# EAGLE design CRDC (EAGLE 9.1.3)
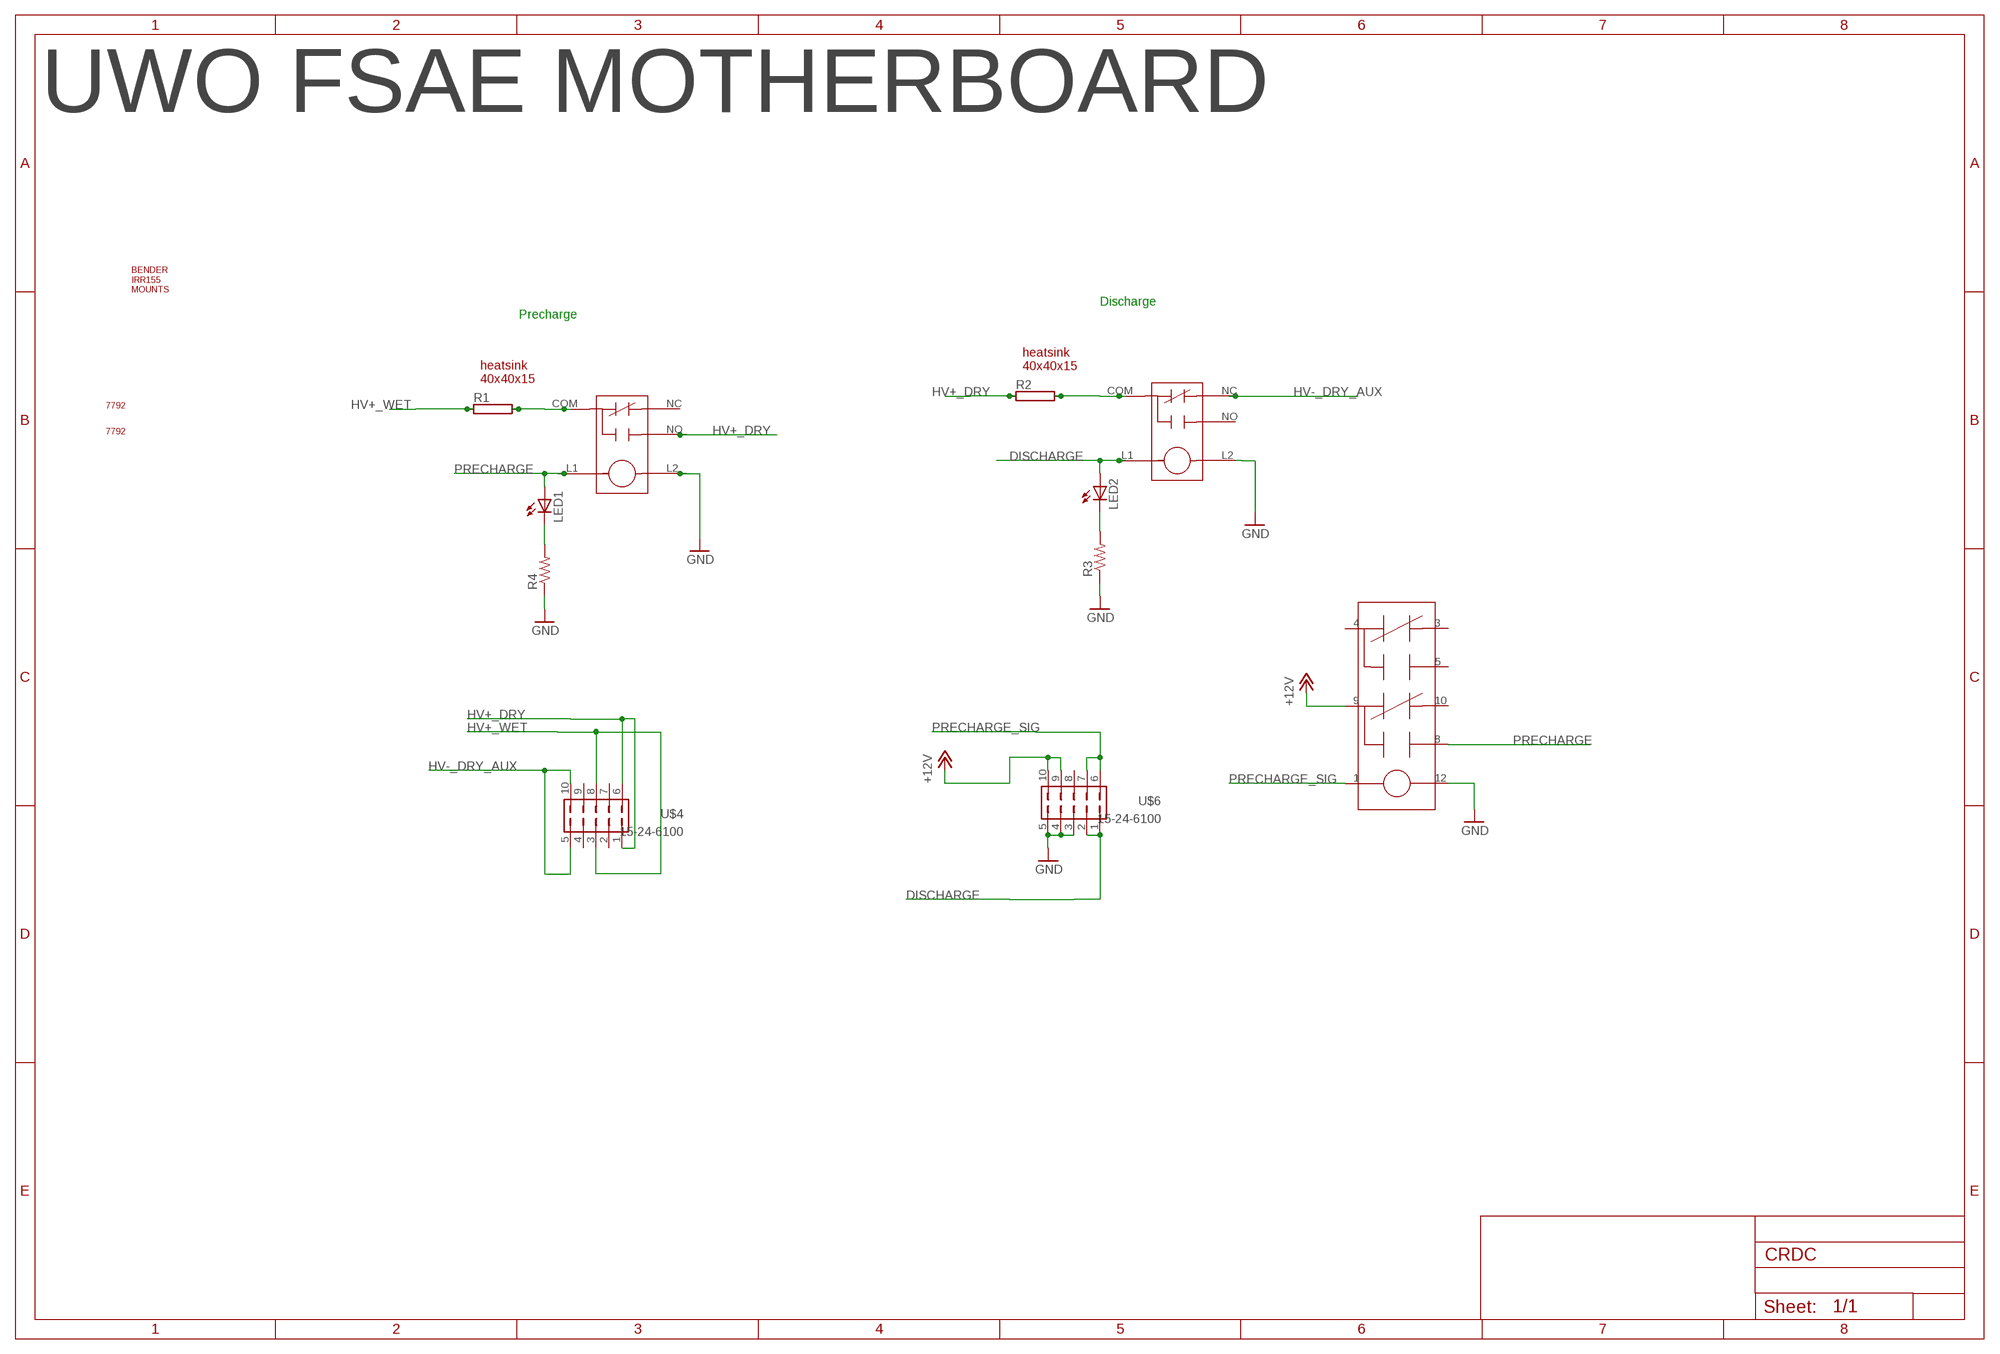
[diagram p0: schematic, sheet 1]

## Parts
LED1  LED3MM  [LED3MM]
LED2  LED3MM  [LED3MM]
R1  RMG100-H  [TO-247-2H]
R2  RMG100-H  [TO-247-2H]
R3  R-US_R0805  [R0805]
R4  R-US_R0805  [R0805]
U$1  G81C335  [G81C335]
U$2  G81C335  [G81C335]
U$3  BENDER_IRR155  [BENDER_IRR155]
U$4  15-24-6100  [15-24-6100]
U$5  7792  [7792]
U$6  15-24-6100  [15-24-6100]
U$7  V23079B1203B301  [V23079B1203B301]
U$8  HEATSINK40X40X15  [HEATSINK40X40X15]
U$9  HEATSINK40X40X15  [HEATSINK40X40X15]
U$10  7792  [7792]

## Nets
+12V: U$6.9 U$6.10 U$7.9
DISCHARGE: LED2.A U$2.L1 U$6.1 U$6.2
GND: R3.1 R4.1 U$1.L2 U$2.L2 U$6.3 U$6.4 U$6.5 U$7.12
HV+_DRY [HV]: R2.1 U$1.NO U$4.1 U$4.6
HV+_WET [HV]: R1.1 U$4.3 U$4.8
HV-_DRY_AUX [HV]: U$2.NC U$4.5 U$4.10
N$1: LED2.K(C) R3.2
N$4: R2.2 U$2.COM
N$5: LED1.K(C) R4.2
N$21: R1.2 U$1.COM
PRECHARGE: LED1.A U$1.L1 U$7.8
PRECHARGE_SIG: U$6.6 U$6.7 U$7.1
Unconnected: U$1.NC U$2.NO U$4.2 U$4.4 U$4.7 U$4.9 U$6.8 U$7.3 U$7.4 U$7.5 U$7.10

## Notes on the sheet
- UWO FSAE MOTHERBOARD
- Discharge
- Precharge

## Library data of the parts
LED1 LED2 = ACC-MB-R0:LED: LED OSRAM: - CHIPLED LG R971, LG N971, LY N971, LG Q971, LY Q971, LO R971, LY R971 LH N974, LH R974 LS Q976, LO Q976, LY Q976 LO Q996 - Hyper CHIPLED LW Q18S LB Q993, LB Q99A, LB R99A - SideLED LS A670, LO A670, LY A670, LG A670, LP A670 LB A673, LV A673, LT A673, LW A673 LH A674 LY A675 LS A676, LA A676, LO A676, LY A676, LW A676 LS A679, LY A679, LG A679 - Hyper Micro SIDELED® LS Y876, LA Y876, LO Y876, LY Y876 LT Y87S - SmartLED LW L88C, LW L88S LB L89C, LB L89S, LG L890 LS L89K, LO L89K, LY L89K LS L896, LA L896, LO L896, LY L896 - TOPLED LS T670, LO T670, LY T670, LG T670, LP T670 LSG T670, LSP T670, LSY T670, LOP T670, LYG T670 LG T671, LOG T671, LSG T671 LB T673, LV T673, LT T673, LW T673 LH T674 LS T676, LA T676, LO T676, LY T676, LB T676, LH T676, LSB T676, LW T676 LB T67C, LV T67C, LT T67C, LS T67K, LO T67K, LY T67K, LW E67C LS E67B, LA E67B, LO E67B, LY E67B, LB E67C, LV E67C, LT E67C LW T67C LS T679, LY T679, LG T679 LS T770, LO T770, LY T770, LG T770, LP T770 LB T773, LV T773, LT T773, LW T773 LH T774 LS E675, LA E675, LY E675, LS T675 LS T776, LA T776, LO T776, LY T776, LB T776 LHGB T686 LT T68C, LB T68C - Hyper Mini TOPLED® LB M676 - Mini TOPLED Santana® LG M470 LS M47K, LO M47K, LY M47K Source: http://www.osram.convergy.de LUXEON: - LUMILED® LXK2-PW12-R00, LXK2-PW12-S00, LXK2-PW14-U00, LXK2-PW14-V00 LXK2-PM12-R00, LXK2-PM12-S00, LXK2-PM14-U00 LXK2-PE12-Q00, LXK2-PE12-R00, LXK2-PE12-S00, LXK2-PE14-T00, LXK2-PE14-U00 LXK2-PB12-K00, LXK2-PB12-L00, LXK2-PB12-M00, LXK2-PB14-N00, LXK2-PB14-P00, LXK2-PB14-Q00 LXK2-PR12-L00, LXK2-PR12-M00, LXK2-PR14-Q00, LXK2-PR14-R00 LXK2-PD12-Q00, LXK2-PD12-R00, LXK2-PD12-S00 LXK2-PH12-R00, LXK2-PH12-S00 LXK2-PL12-P00, LXK2-PL12-Q00, LXK2-PL12-R00 Source: www.luxeon.com KINGBRIGHT: KA-3528ASYC Source: www.kingbright.com
R1 R2 = ACC-MB-R0:RMG100: TO-247 Power Resistor - RMG 100 Series Source: www.token.com.tw .. power-resistor-rmg100pdf; OC_FARNELL: unknown; OC_NEWARK: unknown
R3 R4 = ACC-MB-R0:R-US_: RESISTOR, American symbol; SPICEPREFIX: R
U$1 U$2 = ACC-MB-R0:G81C335
U$3 = ACC-MB-R0:BENDER_IRR155
U$4 U$6 = ACC-MB-R0:15-24-6100
U$5 U$10 = ACC-MB-R0:7792
U$7 = ACC-MB-R0:V23079B1203B301
U$8 U$9 = ACC-MB-R0:HEATSINK40X40X15

## Net classes
0 default: width 1 mm, clearance 0.152 mm
1 LV: clearance 0.001 mm
2 HV: clearance 2.5 mm

## Board
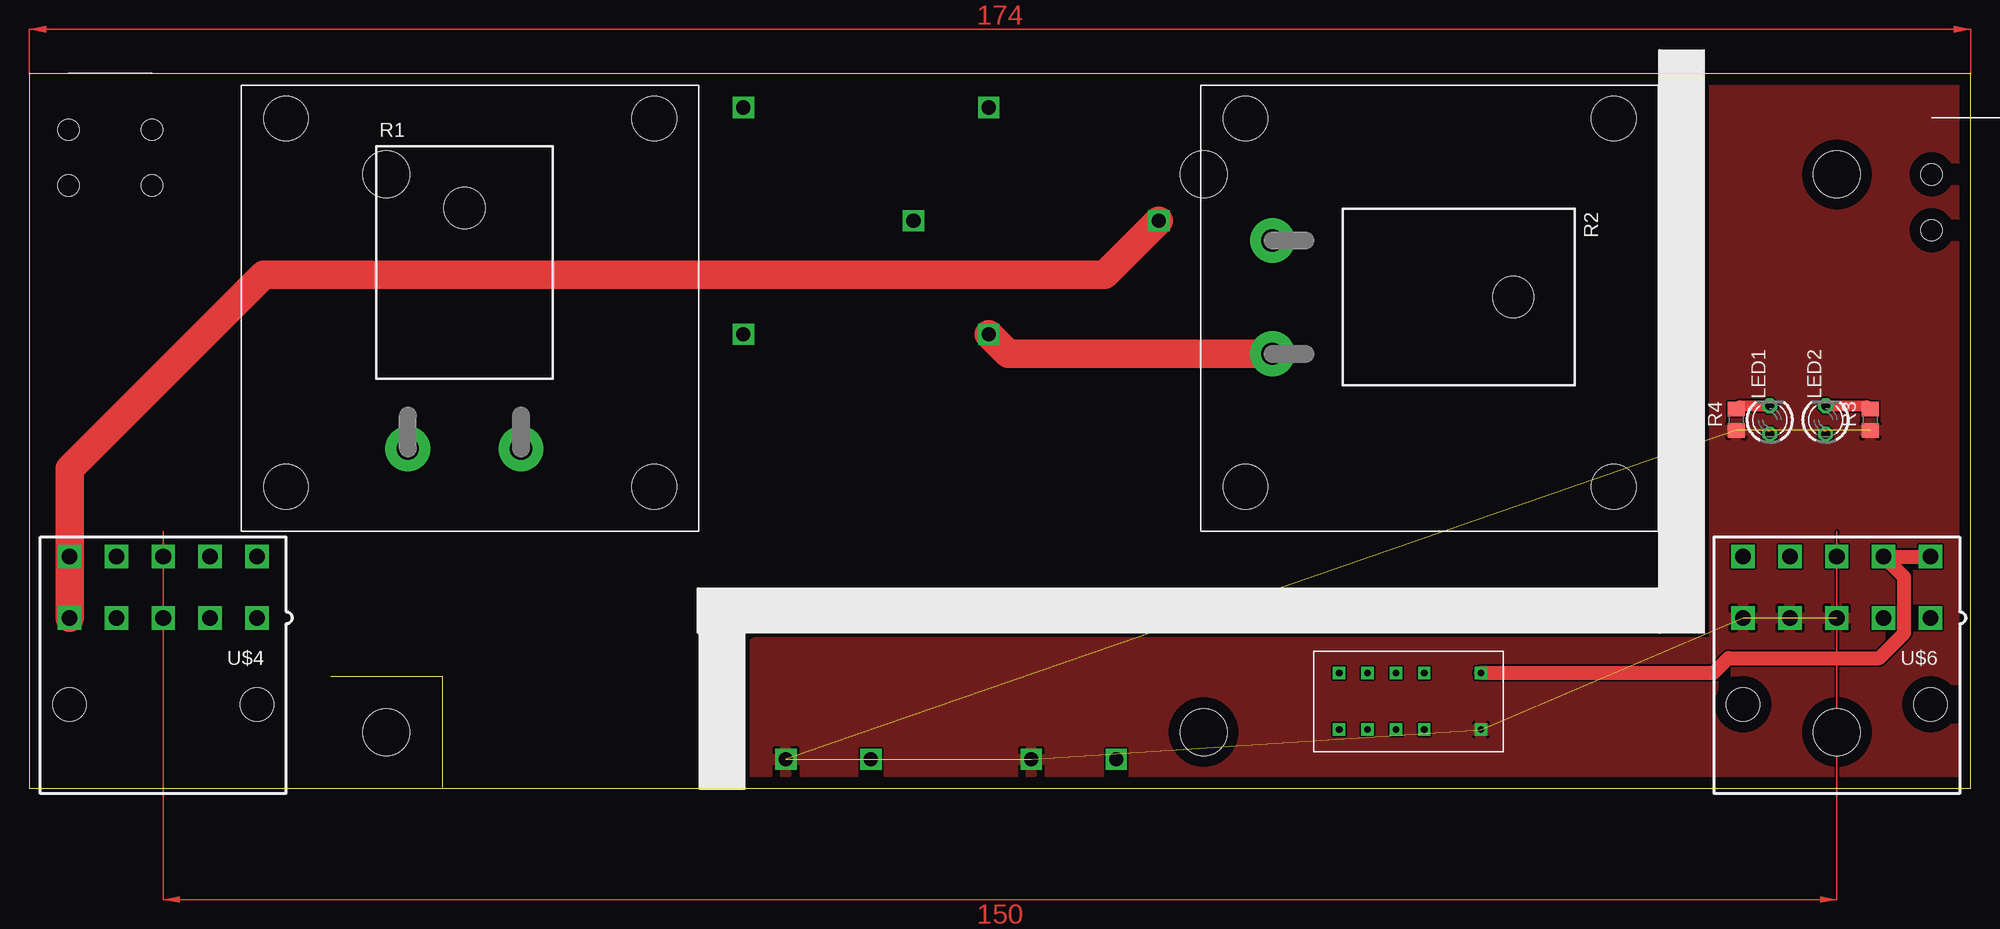
[diagram p1: board, top side]
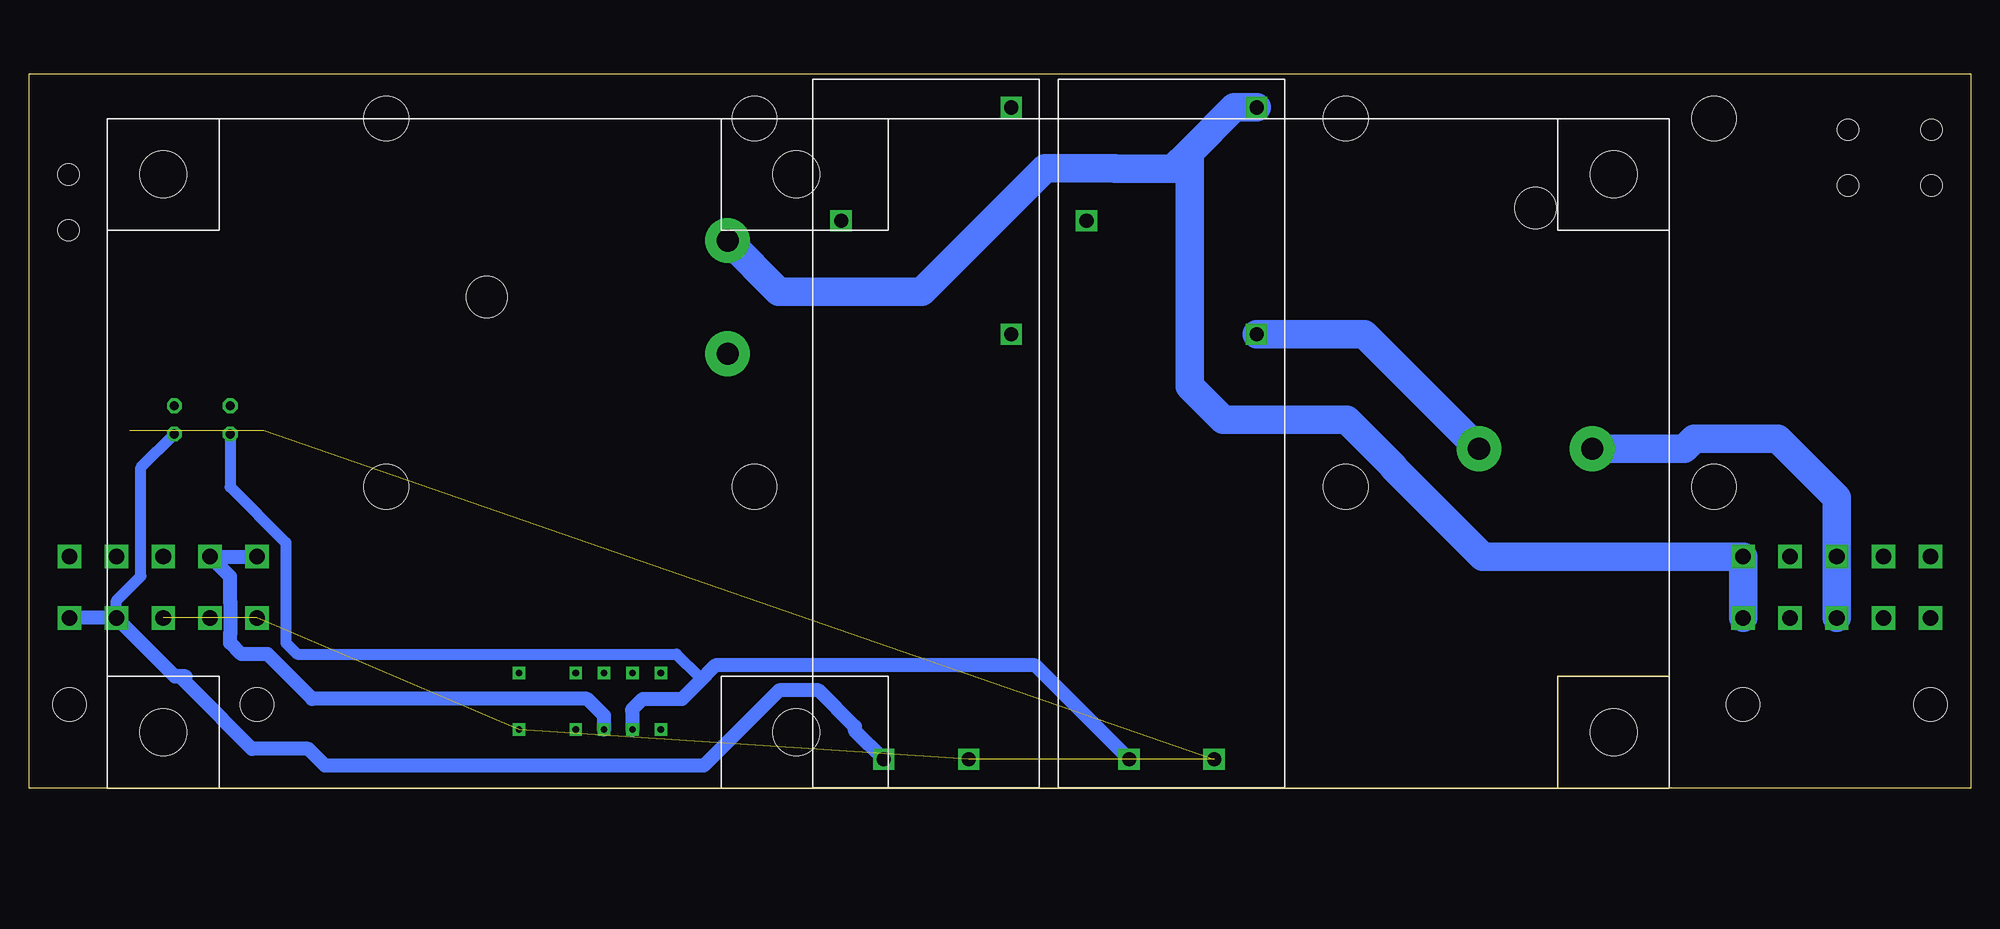
[diagram p2: board, bottom side, seen from below]

Size 174 x 64 mm. Coordinates in mm from the lower left corner, seen from the top.
Outline: 0,0 174,0 174,64 0,64 0,0
Copper layers (1*16): Top 0.035mm / dielectric 1.5mm / Bottom 0.035mm
Design rules "default": minimum track width 6mil, minimum drill 0.35mm, track to track 6mil, track to pad 6mil, pad to pad 6mil, via to via 6mil, smd to smd 6mil, copper to edge 40mil, drill to drill 6mil, minimum pad ring 10mil, minimum via ring 8mil, stop-mask expansion 4mil, vias tented up to drill 0mil, thermal gap 10mil

### Footprints (pad centres in the part's own frame; a part is rotated, then mirrored left to right if it is on the bottom)
LED3MM = drill 0.813 octagon: A -1.27,0; K 1.27,0
TO-247-2H = drill 2 pad 4: 1 -5.08,-21.59; 2 5.08,-21.59 | hole 3.7: 0,0
R0805 = smd 1.3 x 1.5: 1 -0.95,0; 2 0.95,0
G81C335 = drill 1.27 square: COM 20.32,0; L1 58.42,-11.43; L2 58.42,-3.81; NC 10.16,-15.24; NO 0,0
BENDER_IRR155 = hole 4.2: 5,5; 5,55; 78.25,55; 78.25,5; 135,55; 135,5
15-24-6100 = drill 1.4 square: 1 8.4,-2.75; 2 4.2,-2.75; 3 0,-2.75; 4 -4.2,-2.75; 5 -8.4,-2.75; 6 8.4,2.75; 7 4.2,2.75; 8 0,2.75; 9 -4.2,2.75; 10 -8.4,2.75 | hole 3: 8.4,-10.5; -8.4,-10.5
7792 = hole 1.9: 0,5; 0,0; 7.5,0; 7.5,5
V23079B1203B301 = drill 0.6 square: 1 0,-5.08; 3 5.08,-5.08; 4 7.62,-5.08; 5 10.16,-5.08; 6 12.7,-5.08; 7 12.7,0; 8 10.16,0; 9 7.62,0; 10 5.08,0; 12 0,0
HEATSINK40X40X15 = hole 4: 0,0; 33,0; 33,33; 0,33

### Placement (x,y rotation side)
LED1  156,33 90 top
LED2  161,33 90 top
R1  39,52 0 top
R2  133,44 270 top
R3  165,33 90 top
R4  153,33 90 top
U$1  64,61 270 bottom
U$2  86,61 270 bottom
U$3  27,60 180 bottom
U$4  12,18 0 top
U$5  3.5,54 0 top
U$6  162,18 0 top
U$7  130.1,5.24 180 top
U$8  109,27 0 top
U$9  23,27 0 top
U$10  170.5,50 0 top

### Tracks (layer width: path | path; a pad name or v marks a point on that pad's centre or on a via)
+12V
  Bottom 1.27: U$6.10 U$6.9 156,18.95 156,16.66 155.96,16.63 155.96,13.87 156,13.84 156,13 155,12 152.64,12 148.64,8 124,8 122.48,6.48 U$7.9
DISCHARGE
  Bottom 1: U$6.2 166.2,16.8 164,19 164,28.73 LED2.A
  Bottom 1.27: U$6.1 U$6.2 160.95,10 160.5,10 | 160,10 160.5,10 | U$2.L1 100,5.15 100,5.5 103.25,8.75 106.8,8.75 113.56,2 147.5,2 149,3.5 154.06,3.5 156.75,6.2 156.75,6.25 160.5,10
GND  (7 unrouted)
  pour Top: 65,13 65,-3 177,-3 177,69 151,69 151,13
HV+_DRY
  Bottom 2.54: U$4.1 U$4.6 43.75,20.75 51.71,28.71 51.71,28.77 55.94,33 67,33 70,36 70,57 | 70,57 66,61 U$1.NO | 70,57 71.5,55.5 76.66,55.5 76.73,55.56 82.94,55.56 94,44.5 106.83,44.5 R2.1
HV+_WET
  Bottom 2.54: R1.1 25.65,30.41 24.77,31.29 17.29,31.29 12,26 U$4.8 U$4.3
HV-_DRY_AUX
  Top 2.54: U$4.5 U$4.10 3.6,28.6 21,46 96.4,46 U$2.NC
N$1
  Top 1: LED2.K 164.68,34.27 R3.2
N$4
  Top 2.54: R2.2 87.76,38.92 U$2.COM
N$5
  Top 1: R4.2 153.32,34.27 LED1.K
N$21
  Bottom 2.54: U$1.COM 54.35,40.68 R1.2
PRECHARGE
  Bottom 1: LED1.A 156,27 151,22 151,13 150,12 116,12 114,10 114,9.5
  Bottom 1.27: U$7.8 119.94,6.94 120,7 119,8 115.5,8 114,9.5 112.5,11 83.85,11 U$1.L1
PRECHARGE_SIG
  Top 1.27: U$7.1 150.96,10.32 152.29,11.65 165.81,11.65 168.04,13.87 168.04,18.91 U$6.7 U$6.6
(copper drawn outside any net)
  shapes: Top area x3